# Altium schematic sheet USB_UART_C.SchDoc
size A0; SheetNumber: 1; SheetTotal: 1
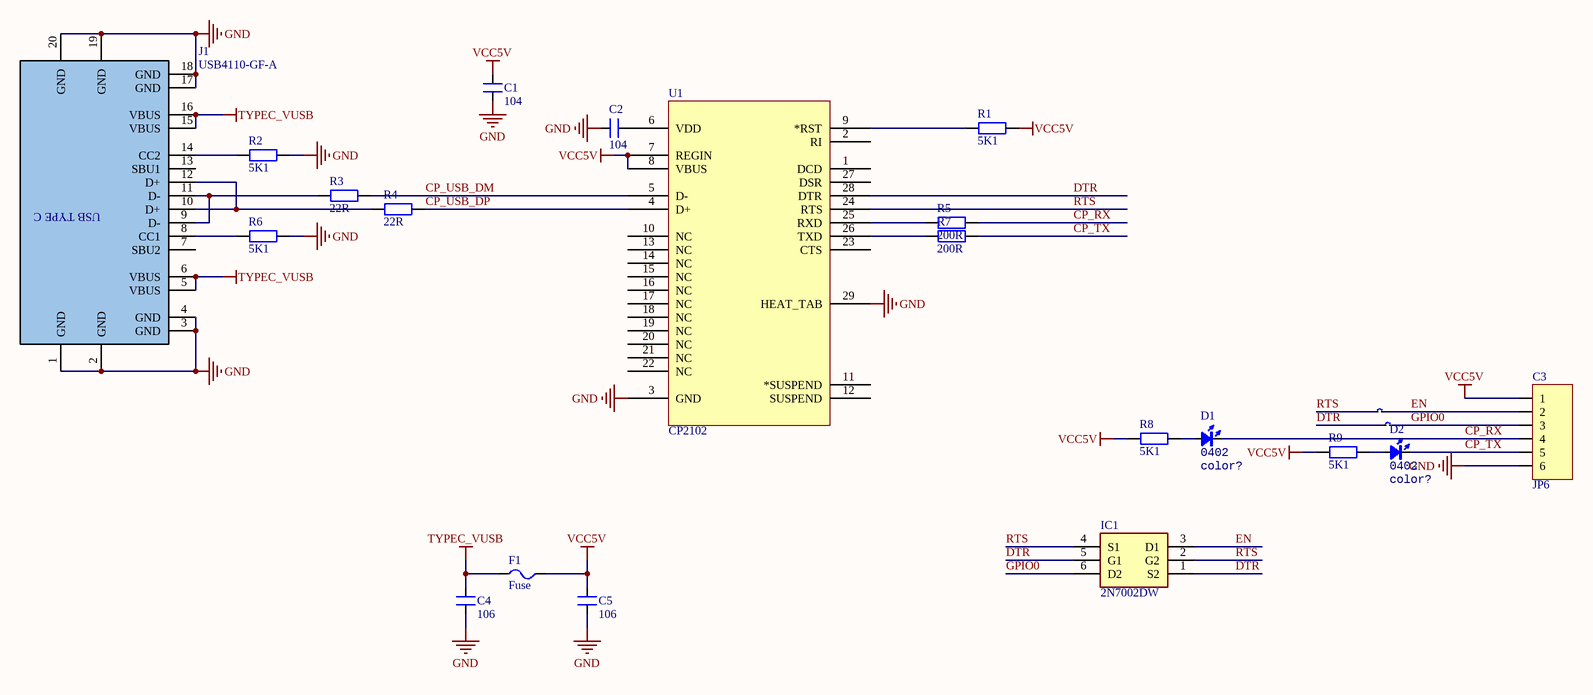
[diagram p0: USB_UART_C.SchDoc]

## Parts
C1  104  [CAP_0402]
C2  104  [CAP_0402]
C3  JP6  [JP6-C1T]
C4  106  [CAP_0402]
C5  106  [CAP_0402]
D1  Type: 0402  [LED_0402_RED]  (hidden comment: color?)
D2  Type: 0402  [LED_0402_RED]  (hidden comment: color?)
F1  Fuse  [RES-SMD-1812]
IC1  2N7002DW  [SOT65P210X110-6N]
J1  USB4110-GF-A  [USB4110GFA]
R1  5K1  [RES_0402]
R2  5K1  [RES_0402]
R3  22R  [RES_0402]
R4  22R  [RES_0402]
R5  200R  [RES_0402]
R6  5K1  [RES_0402]
R7  200R  [RES_0402]
R8  5K1  [RES_0402]
R9  5K1  [RES_0402]
SB1  SB  [SB_0603]  (value not drawn)
SB2  SB  [SB_0603]  (value not drawn)
U1  CP2102  [QFN-28]

## Nets
GND: C1.2 C2.1 C3.6 C4.2 C5.2 J1.1(GND) J1.2(GND) J1.3(GND) J1.4(GND) J1.17(GND) J1.18(GND) J1.19(GND) J1.20(GND) R2.2 R6.2 U1.3(GND) U1.29(HEAT_TAB)
TYPEC_VUSB: C4.1 F1.1 J1.5(VBUS) J1.6(VBUS) J1.15(VBUS) J1.16(VBUS)
VCC5V: C1.1 C3.1 C5.1 F1.2 R1.2 R8.2 R9.2 U1.7(REGIN) U1.8(VBUS)
CP_RX: C3.4 D1.2(K) R5.2
CP_TX: C3.5 D2.2(K) R7.2
CP_USB_DM: R3.2 U1.5(D-)
CP_USB_DP: R4.2 U1.4(D+)
DTR: IC1.1(S2) IC1.5(G1) SB2.1 U1.28(DTR)
EN: C3.2 IC1.3(D1) SB1.2
GPIO0: C3.3 IC1.6(D2) SB2.2
RTS: IC1.2(G2) IC1.4(S1) SB1.1 U1.24(RTS)
NetC2_2: C2.2 U1.6(VDD)
NetD1_1: D1.1(A) R8.1
NetD2_1: D2.1(A) R9.1
NetJ1_8: J1.8(CC1) R6.1
NetJ1_9: J1.9(D-) J1.11(D-) R3.1
NetJ1_10: J1.10(D+) J1.12(D+) R4.1
NetJ1_14: J1.14(CC2) R2.1
NetR1_1: R1.1 U1.9(*RST)
NetR5_1: R5.1 U1.25(RXD)
NetR7_1: R7.1 U1.26(TXD)

Not connected (* = marked no-connect by the designer): J1 7(SBU2) 13(SBU1); U1 1(DCD) 2(RI) 10(NC) 11(*SUSPEND) 12(SUSPEND) 13(NC) 14(NC) 15(NC) 16(NC) 17(NC) 18(NC) 19(NC) 20(NC) 21(NC) 22(NC) 23(CTS) 27(DSR)

## Library data of the parts
C1 C2 C4 C5 = CM: Cap SMD; Value: 103
C3 = JP6: WR-PHD 2.54 mm Angled Socket Header; Manufacturer: W¨¹rth Elektronik eiSos GmbH; partNo: 613006143121; ComponentLink1 Description: Manufacturer; ComponentLink2 Description: Datasheet; NoPins: 06; Created Date: 29 March 2013; ComponentLink1URL: http://www.we-online.com; ComponentLink2URL: http://katalog.we-online.de/em/datasheet/6130xx143121.pdf; Created by: Karrer Zheng
D1 D2 = LED_0402: LED; Value: color?
IC1 = 2N7002DW: Integrated Circuit; Manufacturer_Name: ON Semiconductor; Datasheet Link: https://datasheet.datasheetarchive.com/originals/distributors/Datasheets_SAMA/951ecc1ab16cbf3d5524c3c8fb4b034a.pdf; Height: 1.1mm; Manufacturer_Part_Number: 2N7002DW; Mouser Part Number: 512-2N7002DW; Mouser Price/Stock: https://www.mouser.co.uk/ProductDetail/ON-Semiconductor/2N7002DW?qs=4aVxpR%2FL9VItb3yGt5CeZg%3D%3D; Arrow Part Number: 2N7002DW; Arrow Price/Stock: https://www.arrow.com/en/products/2n7002dw/on-semiconductor?region=nac
J1 = USB4110-GF-A: USB TYPE C; Manufacturer_Name: GCT (GLOBAL CONNECTOR TECHNOLOGY); Datasheet Link: https://gct.co/files/drawings/usb4110.pdf; Height: 3.26mm; Manufacturer_Part_Number: USB4110-GF-A; Arrow Part Number: USB4110-GF-A
R1-R9 = R: Resistor R1/4W
U1 = CP2102: USB to TTL; PART DESC: SINGLE-CHIP USB TO UART BRIDGE, QFN28, RoHS.; MFG #1: SILICON LABS; PART NUMBER: CP2102; Value: Value; RefDes: RefDes; Type: DEV